# EAGLE design prog-adapter (EAGLE 7.3.0)
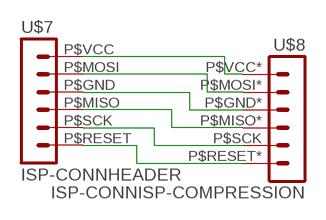
[diagram p0: schematic, sheet 1]

## Parts
U$7  ISP-CONNHEADER  [ISP-HEADER]
U$8  ISP-CONNISP-COMPRESSION  [ISP-COMPRESSION-CONN]

## Nets
N$2: U$7.P$RESET(RESET) U$8.P$RESET*(RESET)
N$4: U$7.P$SCK(SCK) U$8.P$SCK(SCK)
N$6: U$7.P$MISO(MISO) U$8.P$MISO*(MISO)
N$20: U$7.P$GND(GND) U$8.P$GND*(GND)
N$21: U$7.P$MOSI(MOSI) U$8.P$MOSI*(MOSI)
N$23: U$7.P$VCC(VCC) U$8.P$VCC*(VCC)

## Library data of the parts
U$7 U$8 = _myLIB:ISP-CONN: 6 x 0.1 inch Header 40x1 0.1inch Male Breakaway header can be used. - 4UCON 00834 <http://www.4uconnector.com/online/SearchPro.asp?FormName=ProSearch&FormAction=search&s_GroupNo=&s_keyword=00834> For female part, if possible use 6 x 1 without breaking.

## Board
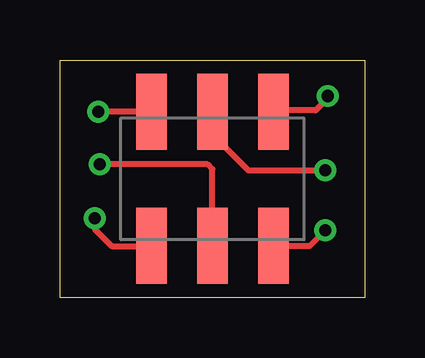
[diagram p1: board, top side]
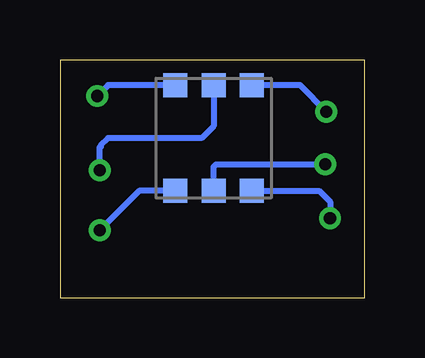
[diagram p2: board, bottom side, seen from below]

Size 12.7 x 9.9 mm. Coordinates in mm from the lower left corner, seen from the top.
Outline: 0,0 0,9.9 12.7,9.9 12.7,0 0,0
Copper layers (1*16): Top 0.035mm / dielectric 0.5mm / Bottom 0.035mm
Design rules "NYAKARUHAZ *": minimum track width 6mil, minimum drill 20mil, track to track 6mil, track to pad 6mil, pad to pad 6mil, via to via 10mil, smd to smd 6mil, copper to edge 20mil, drill to drill 8mil, minimum pad ring 10mil, minimum via ring 8mil, stop-mask expansion 4mil, vias tented up to drill 0mil, thermal gap 6mil

### Footprints (pad centres in the part's own frame; a part is rotated, then mirrored left to right if it is on the bottom)
ISP-HEADER = smd 1.27 x 3.175: P$GND 2.54,2.794; P$MISO -2.54,-2.794; P$MOSI 0,2.794; P$RESET 2.54,-2.794; P$SCK 0,-2.794; P$VCC -2.54,2.794
ISP-COMPRESSION-CONN = smd 1 x 1: P$GND* -1.6,2.2; P$MISO* 1.6,-2.2; P$MOSI* 0,2.2; P$RESET* -1.6,-2.2; P$SCK 0,-2.2; P$VCC* 1.6,2.2

### Placement (x,y rotation side)
U$7  6.35,4.95 0 top
U$8  6.3,6.65 0 bottom

### Tracks (layer width: path | path; a pad name or v marks a point on that pad's centre or on a via)
N$2  (via drill 0.51 pad 0.61)
  Top 0.254: v11.05,2.8 10.4,2.15 U$7.P$RESET
  Bottom 0.254: U$8.P$RESET* 9.4,4.45 v11.05,2.8
N$4  (via drill 0.51 pad 0.61)
  Top 0.254: U$7.P$SCK 6.35,5.35 6.15,5.55 v1.65,5.55
  Bottom 0.254: U$8.P$SCK 6.3,5.45 6.2,5.55 v1.65,5.55
N$6  (via drill 0.51 pad 0.61)
  Top 0.254: v1.45,3.3 1.45,2.85 2.15,2.15 U$7.P$MISO
  Bottom 0.254: U$8.P$MISO* 1.9,4.45 1.45,4 v1.45,3.3
N$20  (via drill 0.51 pad 0.61)
  Top 0.254: v11.15,8.4 11.15,8.3 10.65,7.8 8.95,7.8 U$7.P$GND
  Bottom 0.254: U$8.P$GND* 10.7,8.85 v11.15,8.4
N$21  (via drill 0.51 pad 0.61)
  Top 0.254: U$7.P$MOSI 6.35,6.8 7.85,5.3 v11.05,5.3
  Bottom 0.254: U$8.P$MOSI* 6.3,7.15 6.8,6.65 10.7,6.65 11,6.35 11,6.3 11.05,6.25 v11.05,5.3
N$23  (via drill 0.51 pad 0.61)
  Top 0.254: U$7.P$VCC v1.61,7.74 v1.6,7.75
  Bottom 0.254: v1.6,7.75 2.7,8.85 U$8.P$VCC*